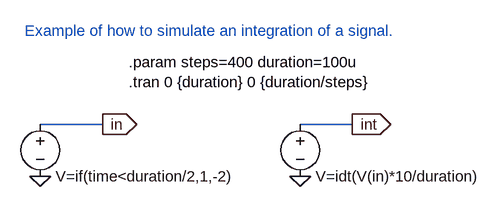
[diagram p0: schematic integrator.asc]
integrator.asc, the LTspice schematic file:
Version 4
SHEET 1 880 680
WIRE 192 208 96 208
WIRE 576 208 496 208
FLAG 96 288 0
FLAG 496 288 0
FLAG 192 208 in
IOPIN 192 208 Out
FLAG 576 208 int
IOPIN 576 208 Out
SYMBOL Voltage 96 192 R0
WINDOW 0 24 16 Invisible 2
SYMATTR InstName V1
SYMATTR Value V=if(time<duration/2,1,-2)
SYMATTR Prefix B
SYMBOL Voltage 496 192 R0
WINDOW 0 24 16 Invisible 2
SYMATTR InstName V2
SYMATTR Value V=idt(V(in)*10/duration)
SYMATTR Prefix B
TEXT 232 112 Left 2 !.param steps=400 duration=100u\n.tran 0 {duration} 0 {duration/steps}
TEXT 72 64 Left 2 ;Example of how to simulate an integration of a signal.

The netlist it stands for:
* integrator.asc
B§V1 in 0 V=if(time<duration/2,1,-2)
B§V2 int 0 V=idt(V(in)*10/duration)
.param steps=400 duration=100u
.tran 0 {duration} 0 {duration/steps}
* Example of how to simulate an integration of a signal.
.backanno
.end